# Altium schematic sheet MISC.SchDoc
size A4
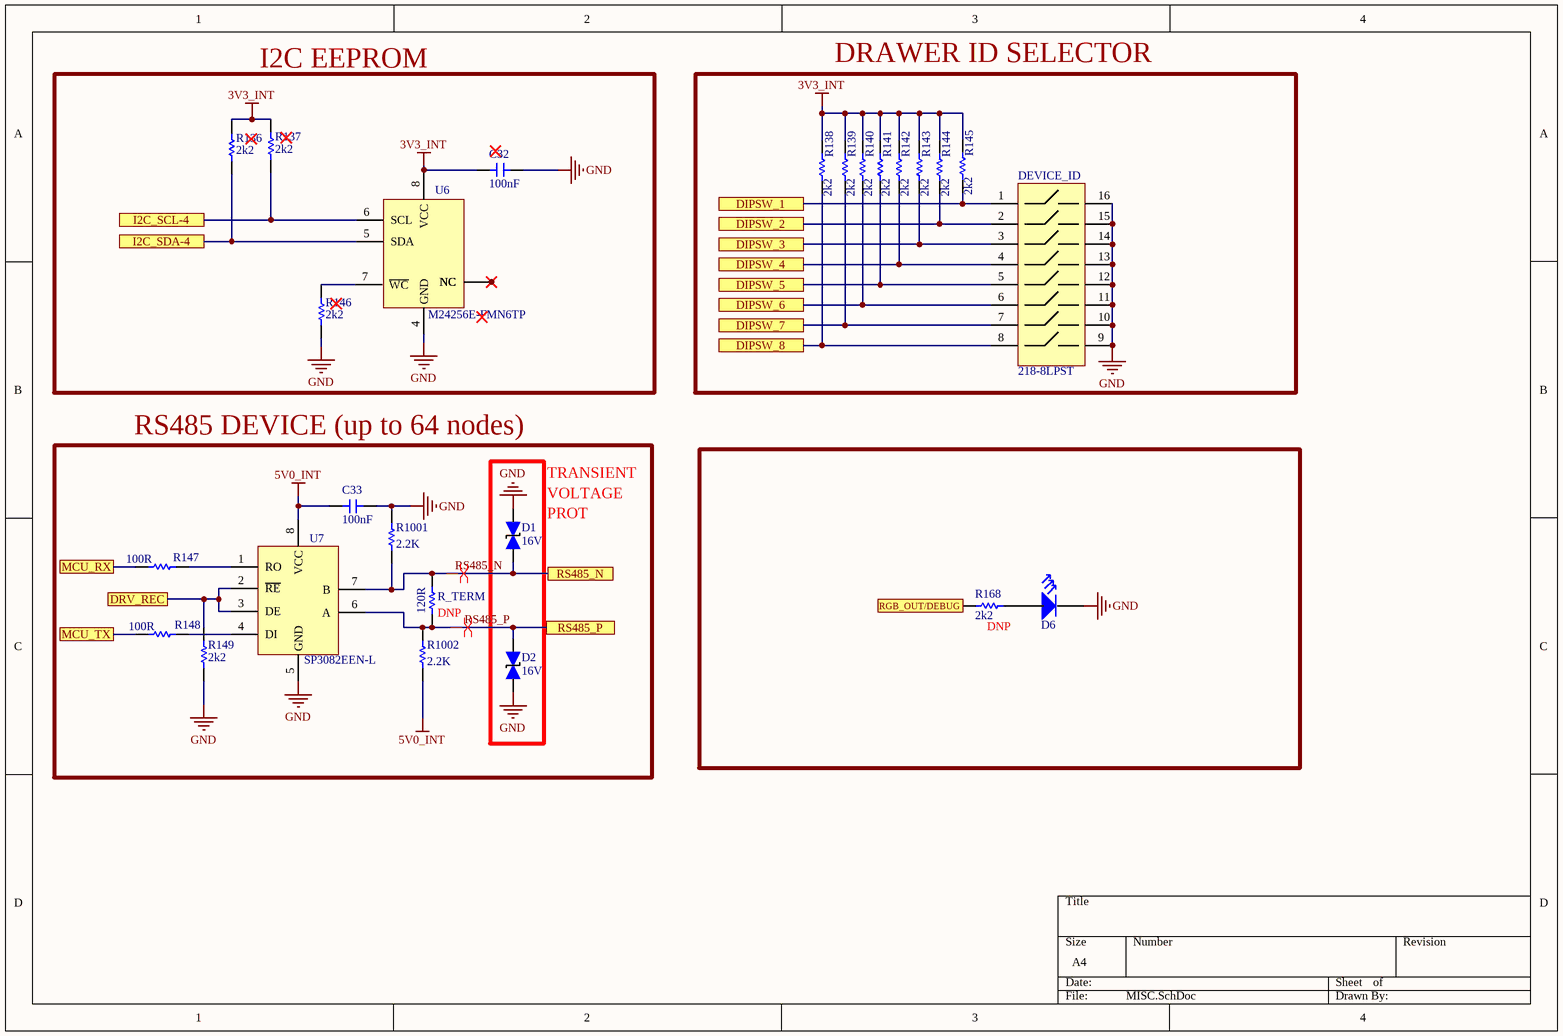
[diagram p0: MISC.SchDoc]

## Parts
C32  value 100nF  [CAP_0402_CER]  (hidden comment: CL05B104KP5NNNC)
C33  value 100nF  [CAP_0402_CER]  (hidden comment: CL05B104KP5NNNC)
D1  value 16V  [SOD-123F]  (hidden comment: SMF16CA)
D2  value 16V  [SOD-123F]  (hidden comment: SMF16CA)
D6  HSMM-C170  [LED_0805_SMD]  (value not drawn)
DEVICE_ID  218-8LPST  [218-8LPST]
R136  value 2k2  [RES_0402_SMD]  (hidden comment: RMCF0402JT2K20)
R137  value 2k2  [RES_0402_SMD]  (hidden comment: RMCF0402JT2K20)
R138  value 2k2  [RES_0402_SMD]  (hidden comment: RMCF0402JT2K20)
R139  value 2k2  [RES_0402_SMD]  (hidden comment: RMCF0402JT2K20)
R140  value 2k2  [RES_0402_SMD]  (hidden comment: RMCF0402JT2K20)
R141  value 2k2  [RES_0402_SMD]  (hidden comment: RMCF0402JT2K20)
R142  value 2k2  [RES_0402_SMD]  (hidden comment: RMCF0402JT2K20)
R143  value 2k2  [RES_0402_SMD]  (hidden comment: RMCF0402JT2K20)
R144  value 2k2  [RES_0402_SMD]  (hidden comment: RMCF0402JT2K20)
R145  value 2k2  [RES_0402_SMD]  (hidden comment: RMCF0402JT2K20)
R146  value 2k2  [RES_0402_SMD]  (hidden comment: RMCF0402JT2K20)
R147  value 100R  [RES_0402_SMD]  (hidden comment: RMCF0402JT100R)
R148  value 100R  [RES_0402_SMD]  (hidden comment: RMCF0402JT100R)
R149  value 2k2  [RES_0402_SMD]  (hidden comment: RMCF0402JT2K20)
R168  value 2k2  Place: DNP  [RES_0402_SMD]  (hidden comment: RMCF0402JT2K20)  (no BOM)
R1001  value 2.2K  [RES_0402_SMD]  (hidden comment: RMCF0402JT2K20)
R1002  value 2.2K  [RES_0402_SMD]  (hidden comment: RMCF0402JT2K20)
R_TERM  value 120R  Place: DNP  [RES_0805_SMD]  (hidden comment: ESR10EZPJ121)  (no BOM)
U6  M24256E-FMN6TP  [8-SOIC(0.154", 3.90mm Width)]
U7  SP3082EEN-L  [8-SOIC(0.154", 3.90mm Width)]

## Blocks framed on the sheet
I2C EEPROM: C32 R136 R137 R146 U6
DRAWER ID SELECTOR: DEVICE_ID R138-R145
RS485 DEVICE (up to 64 nodes): C33 D1 D2 R147-R149 R1001 R1002 R_TERM U7

## Ports
DIPSW_1, DIPSW_2, DIPSW_3, DIPSW_4, DIPSW_5, DIPSW_6, DIPSW_7, DIPSW_8, DRV_REC, I2C_SCL-4, I2C_SDA-4, MCU_RX, MCU_TX, RGB_OUT/DEBUG, RS485_N, RS485_P

## Nets
3V3_INT: C32.2 R136.2 R137.2 R138.1 R139.1 R140.1 R141.1 R142.1 R143.1 R144.1 R145.1 U6.8(VCC)
5V0_INT: C33.2 R1002.1 U7.8(VCC)
GND: C32.1 C33.1 D1.2(A) D2.2(A) D6.C DEVICE_ID.9 DEVICE_ID.10 DEVICE_ID.11 DEVICE_ID.12 DEVICE_ID.13 DEVICE_ID.14 DEVICE_ID.15 DEVICE_ID.16 R146.1 R149.1 R1001.2 U6.4(GND) U7.5(GND)
DIPSW_1: DEVICE_ID.1 R145.2 ; port DIPSW_1
DIPSW_2: DEVICE_ID.2 R144.2 ; port DIPSW_2
DIPSW_3: DEVICE_ID.3 R143.2 ; port DIPSW_3
DIPSW_4: DEVICE_ID.4 R142.2 ; port DIPSW_4
DIPSW_5: DEVICE_ID.5 R141.2 ; port DIPSW_5
DIPSW_6: DEVICE_ID.6 R140.2 ; port DIPSW_6
DIPSW_7: DEVICE_ID.7 R139.2 ; port DIPSW_7
DIPSW_8: DEVICE_ID.8 R138.2 ; port DIPSW_8
DRV_REC: R149.2 U7.2(~{RE}) U7.3(DE) ; port DRV_REC
I2C_SCL-4: R137.1 U6.6(SCL) ; port I2C_SCL-4
I2C_SDA-4: R136.1 U6.5(SDA) ; port I2C_SDA-4
MCU_RX: R147.2 ; port MCU_RX
MCU_TX: R148.2 ; port MCU_TX
RGB_OUT/DEBUG: R168.2 ; port RGB_OUT/DEBUG
RS485_N: D1.1(C) R1001.1 R_TERM.1 U7.7(B) ; port RS485_N
RS485_P: D2.1(C) R1002.2 R_TERM.2 U7.6(A) ; port RS485_P
NetD6_A: D6.A R168.1
NetR146_2: R146.2 U6.7(~{WC})
NetR147_1: R147.1 U7.1(RO)
NetR148_1: R148.1 U7.4(DI)
NetU6_1: U6.1(NC) U6.2(NC) U6.3(NC)

## Layout directives
differential pair: RS485_N, RS485_P

## Notes on the sheet
- (near D1) TRANSIENT
- (near D1) VOLTAGE
- (near D1) PROT

## Library data of the parts
C32 C33 = CAP_GEN_CER: 100nF 0402 Ceramic Capacitor; Voltage: 10V; Place: POP; Part Number: CL05B104KP5NNNC; Power: *; Package: *; Tolerance: *; Operating Temp.: *
D1 D2 = SMF16CA: Unidirectional TVS DIODE 200W 16V-17.8V SOD-123; Manufacturer: ANBON SEMI; Voltage: 17.8V; Place: POP; Part Number: SMF16CA; Power: 200W; Tolerance: N/A; Package: SOD-123F; Operating Temp.: -55°C ~ 150°C
D6 = LED_GEN: Manufacturer: Broadcom; Voltage: 3.3V; Place: POP; Part Number: HSMM-C170; Value: *; Power: *; Tolerance: *; Package: 0805; Operating Temp.: *
DEVICE_ID = 218-8LPST: Dip Switch SPST 8 Position Surface Mount Slide (Standard) Actuator 100mA 20VDC; Manufacturer: CST; Value: SPST-8POS; Place: POP; Tolerance: N/A; Voltage: N/A; Power: N/A; Part Number: 218-8LPST; Package: 218-8LPST; Operating Temp.: -40°C ~ 85°C
R136-R146 R149 = RES_GEN_SMD: Generic Chip Res 2k2; Tolerance: 5 %; Place: POP; Package: *; Part Number: RMCF0402JT2K20; Power: *; Voltage: *; Operating Temp.: *
R147 R148 = RES_GEN_SMD: Generic Chip Res 100R; Tolerance: 5 %; Place: POP; Package: *; Part Number: RMCF0402JT100R; Power: *; Voltage: *; Operating Temp.: *
R168 = RES_GEN_SMD: Generic Chip Res 2k2; Tolerance: 5 %; Package: *; Part Number: RMCF0402JT2K20; Power: *; Voltage: *; Operating Temp.: *
R1001 R1002 = RES_GEN_SMD: Generic Chip Res; Place: P; Package: *; Part Number: RMCF0402JT2K20; Power: *; Tolerance: *; Voltage: *; Operating Temp.: *
R_TERM = RES_GEN_SMD: RES 120 OHM 5% 1/2W 0805; Package: *; Part Number: ESR10EZPJ121; Power: *; Tolerance: 5 %; Voltage: *; Operating Temp.: *
U6 = M24256E-FMN6TP: IC EEPROM 256KBIT I2C 1MHZ 8SO; Manufacturer: STM; Voltage: 1.6V ~ 5.5V; Place: POP; Part Number: M24256E-FMN6TP; Value: 256Kbit; Power: N/A; Tolerance: N/A; Package: 8-SOIC; Operating Temp.: -40°C ~ 85°C
U7 = SP3082EEN-L: 1/1 Transceiver Half RS422, RS485 8-SOIC; Manufacturer: MaxLinear, Inc.; Value: 256nodes; Voltage: 4.5V ~ 5.5V; Place: POP; Part Number: SP3082EEN-L; Power: N/A; Tolerance: N/A; Package: 8-SOIC; Operating Temp.: -40°C ~ 85°C